# Altium schematic sheet lyThuyetMach.SchDoc
size 297 x 209 mm
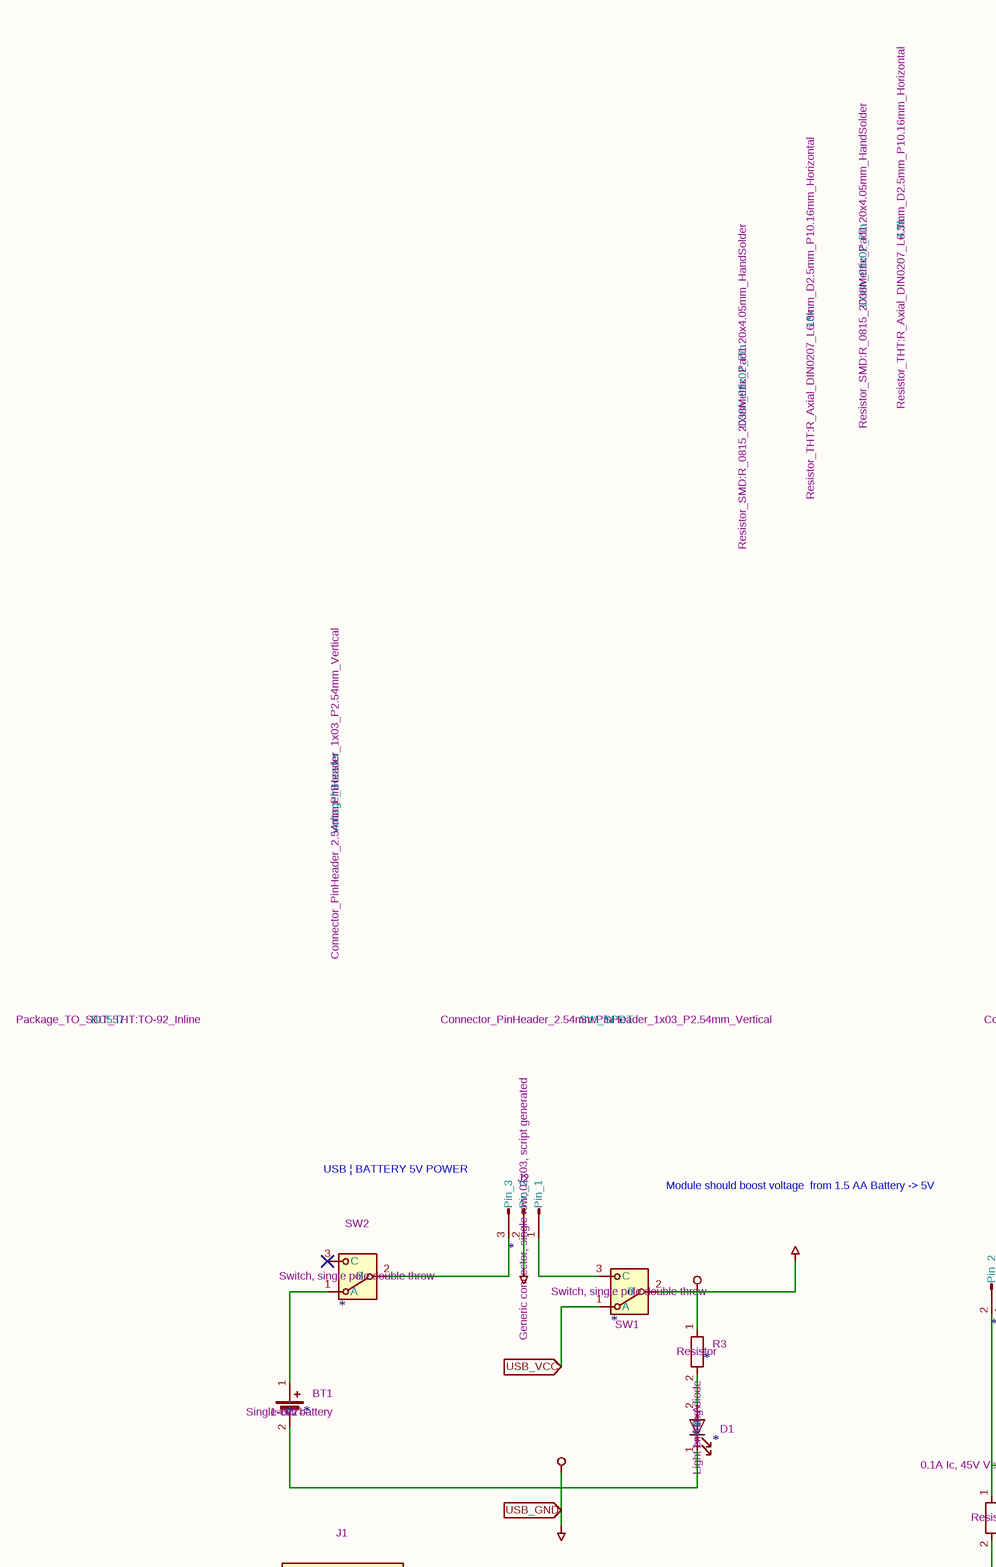
[diagram p0: lyThuyetMach.SchDoc, top left]
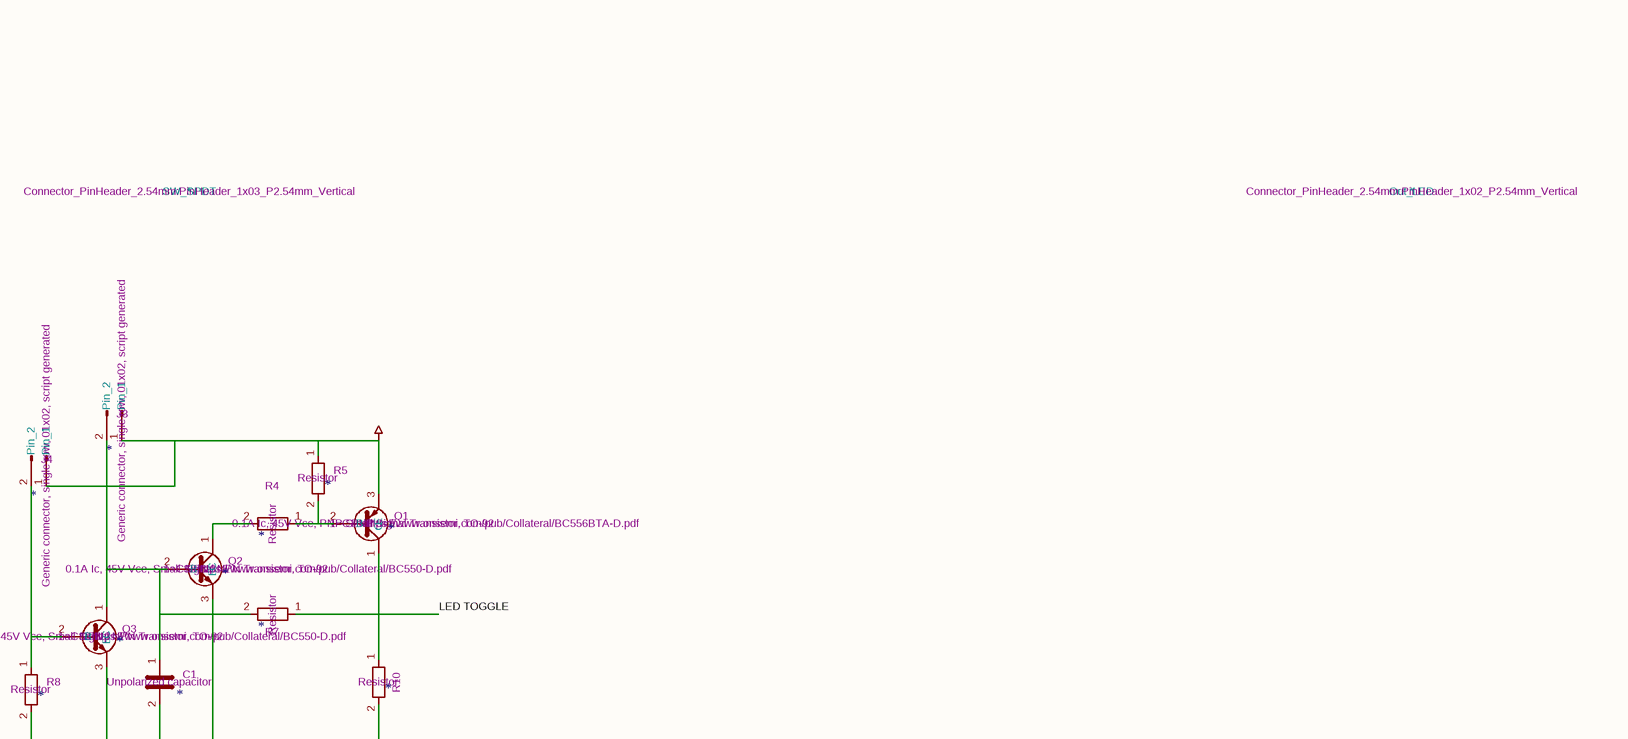
[diagram p1: lyThuyetMach.SchDoc, top right]
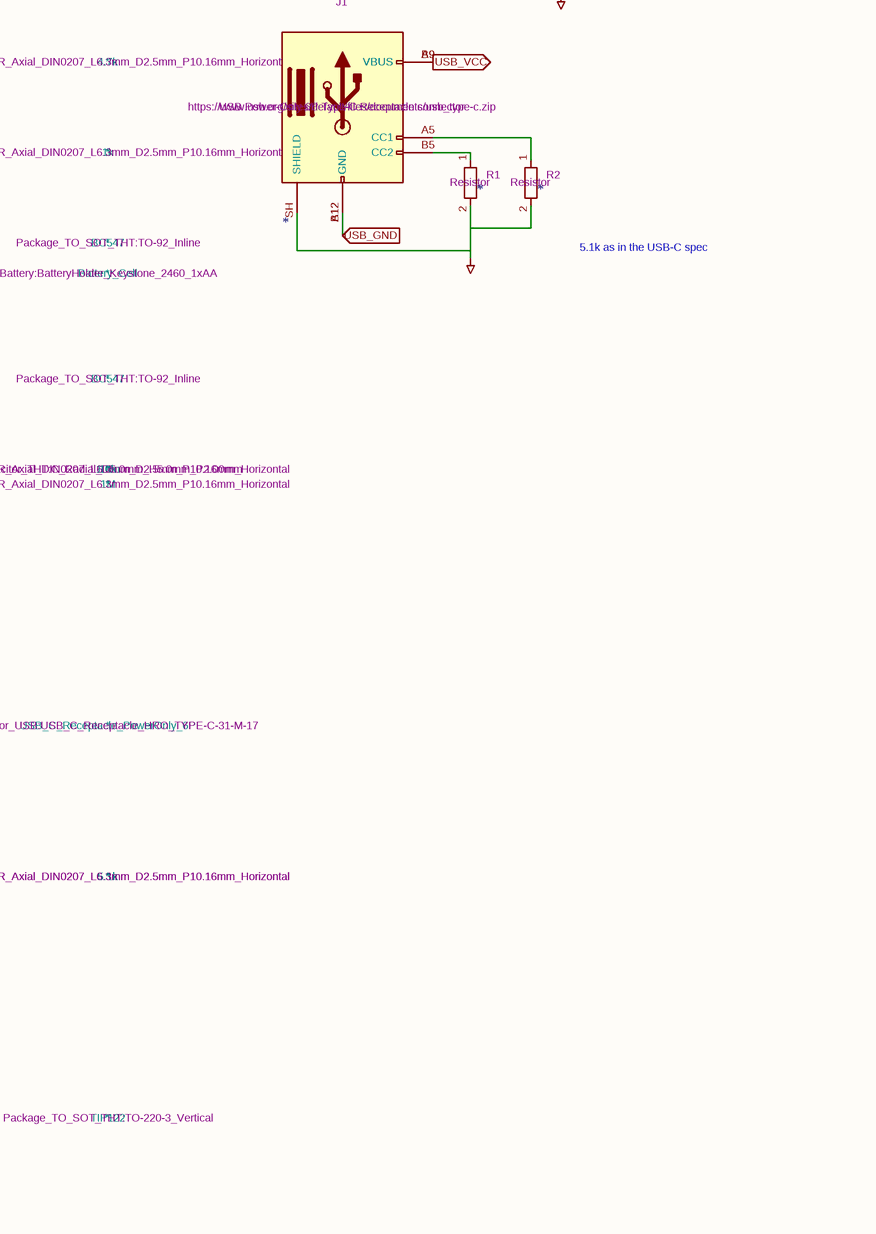
[diagram p2: lyThuyetMach.SchDoc, bottom left]
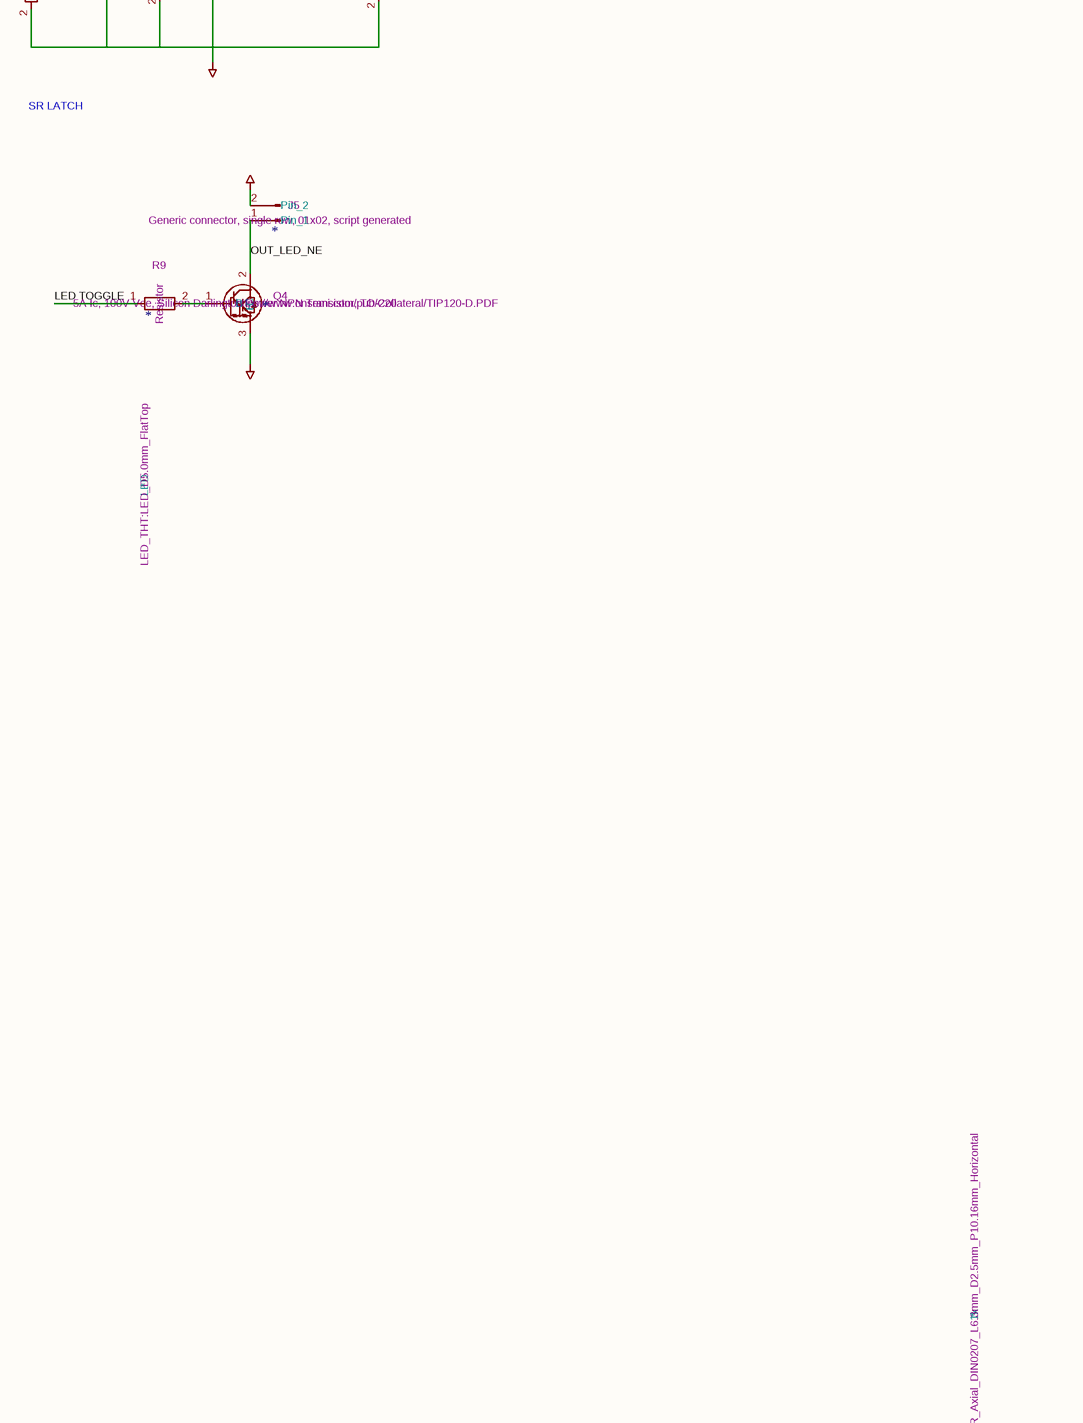
[diagram p3: lyThuyetMach.SchDoc, bottom right]

## Parts
(Parts that share a designator on the sheet are numbered #1, #2 ... from top to bottom, then left to right.)
*#1  *  value Voltage_Booster  Reference: J2  Footprint: Connector_PinHeader_2.54mm:PinHeader_1x03_P2.54mm_Vertical  Description: Generic connector, single row, 01x03, script generated
*#2  *  value Conn_01x02_Pin  Reference: J3  Footprint: Resistor_SMD:R_0815_2038Metric_Pad1.20x4.05mm_HandSolder  Description: Generic connector, single row, 01x02, script generated
*#3  *  value SW_SPDT  Reference: SW2  Footprint: Connector_PinHeader_2.54mm:PinHeader_1x03_P2.54mm_Vertical  Description: Switch, single pole double throw
*#4  *  value Conn_01x02_Pin  Reference: J4  Footprint: Resistor_SMD:R_0815_2038Metric_Pad1.20x4.05mm_HandSolder  Description: Generic connector, single row, 01x02, script generated
*#5  *  value SW_SPDT  Reference: SW1  Footprint: Connector_PinHeader_2.54mm:PinHeader_1x03_P2.54mm_Vertical  Description: Switch, single pole double throw
*#6  *  value 4.7k  Reference: R5  Footprint: Resistor_THT:R_Axial_DIN0207_L6.3mm_D2.5mm_P10.16mm_Horizontal  Description: Resistor
*#7  *  value 1k  Reference: R3  Footprint: Resistor_THT:R_Axial_DIN0207_L6.3mm_D2.5mm_P10.16mm_Horizontal  Description: Resistor
*#8  *  value 4.7k  Reference: R4  Footprint: Resistor_THT:R_Axial_DIN0207_L6.3mm_D2.5mm_P10.16mm_Horizontal  Description: Resistor
*#9  *  value BC557  Reference: Q1  Footprint: Package_TO_SOT_THT:TO-92_Inline  Description: 0.1A Ic, 45V Vce, PNP Small Signal Transistor, TO-92  Sim.Device: PNP  Sim.Pins: 1=C 2=B 3=E
*#10  *  value BC547  Reference: Q2  Footprint: Package_TO_SOT_THT:TO-92_Inline  Description: 0.1A Ic, 45V Vce, Small Signal NPN Transistor, TO-92  Sim.Device: NPN  Sim.Pins: 1=C 2=B 3=E
*#11  *  value Battery_Cell  Reference: BT1  Footprint: Battery:BatteryHolder_Keystone_2460_1xAA  Description: Single-cell battery  Sim.Device: V  Sim.Type: DC  Sim.Pins: 1=+ 2=-
*#12  *  value LED  Reference: D1  Footprint: LED_THT:LED_D5.0mm_FlatTop  Description: Light emitting diode  Sim.Pins: 1=K 2=A
*#13  *  value 10k  Reference: R7  Footprint: Resistor_THT:R_Axial_DIN0207_L6.3mm_D2.5mm_P10.16mm_Horizontal  Description: Resistor
*#14  *  value BC547  Reference: Q3  Footprint: Package_TO_SOT_THT:TO-92_Inline  Description: 0.1A Ic, 45V Vce, Small Signal NPN Transistor, TO-92  Sim.Device: NPN  Sim.Pins: 1=C 2=B 3=E
*#15  *  value 100n  Reference: C1  Footprint: Capacitor_THT:C_Radial_D5.0mm_H5.0mm_P2.00mm  Description: Unpolarized capacitor
*#16  *  value 10k  Reference: R10  Footprint: Resistor_THT:R_Axial_DIN0207_L6.3mm_D2.5mm_P10.16mm_Horizontal  Description: Resistor
*#17  *  value 1M  Reference: R8  Footprint: Resistor_THT:R_Axial_DIN0207_L6.3mm_D2.5mm_P10.16mm_Horizontal  Description: Resistor
*#18  *  value USB_C_Receptacle_PowerOnly_6P  Reference: J1  Footprint: Connector_USB:USB_C_Receptacle_HRO_TYPE-C-31-M-17  Description: USB Power-Only 6P Type-C Receptacle connector
*#19  *  value 5.1k  Reference: R1  Footprint: Resistor_THT:R_Axial_DIN0207_L6.3mm_D2.5mm_P10.16mm_Horizontal  Description: Resistor
*#20  *  value 5.1k  Reference: R2  Footprint: Resistor_THT:R_Axial_DIN0207_L6.3mm_D2.5mm_P10.16mm_Horizontal  Description: Resistor
*#21  *  value Out_LED  Reference: J5  Footprint: Connector_PinHeader_2.54mm:PinHeader_1x02_P2.54mm_Vertical  Description: Generic connector, single row, 01x02, script generated
*#22  *  value 1k  Reference: R9  Footprint: Resistor_THT:R_Axial_DIN0207_L6.3mm_D2.5mm_P10.16mm_Horizontal  Description: Resistor
*#23  *  value TIP122  Reference: Q4  Footprint: Package_TO_SOT_THT:TO-220-3_Vertical  Description: 5A Ic, 100V Vce, Silicon Darlington Power NPN Transistor, TO-220

## Ports
USB_GND (in), USB_VCC (in)

## Nets
USB_GND: *#1.2(Pin_2) *#2.1(Pin_1) *#4.1(Pin_1) *#5.2(B) *#6.1 *#7.1 *#9.3(E) *#10.3(E) *#11.2(-) *#12.1(K) *#14.3(E) *#15.2 *#16.2 *#17.2 *#18.A12(GND) *#18.B12(GND) *#18.SH(SHIELD) *#19.2 *#20.2 *#21.2(Pin_2) *#23.3(E) ; port USB_GND
LED TOGGLE: *#9.1(C) *#13.1 *#16.1 *#22.1
OUT_LED_NE: *#21.1(Pin_1) *#23.2(C)
USB_VCC: *#5.1(A) *#18.A9(VBUS) *#18.B9(VBUS) ; port USB_VCC
Net*#1_1: *#1.1(Pin_1) *#5.3(C)
Net*#1_3: *#1.3(Pin_3) *#3.2(B)
Net*#2_2: *#2.2(Pin_2) *#10.2(B) *#13.2 *#14.1(C) *#15.1
Net*#3_1: *#3.1(A) *#11.1(+)
Net*#4_2: *#4.2(Pin_2) *#14.2(B) *#17.1
Net*#6_2: *#6.2 *#8.1 *#9.2(B)
Net*#7_2: *#7.2 *#12.2(A)
Net*#8_2: *#8.2 *#10.1(C)
Net*#18_A5: *#18.A5(CC1) *#20.1
Net*#18_B5: *#18.B5(CC2) *#19.1
Net*#22_2: *#22.2 *#23.1(B)

Not connected (* = marked no-connect by the designer): *#3 3(C)*

## Notes on the sheet
- USB | BATTERY 5V POWER
- Module should boost voltage
  from 1.5 AA Battery -> 5V
- SR LATCH
- 5.1k as in the USB-C spec
- 1
- 2
- 3
- 4
- 5
- 6
- A
- B
- C
- D
- Title:
- File: lyThuyetMach.kicad_sch
- Sheet: /
- KiCad E.D.A.  kicad (5.1.4)-1
- Size: A4
- Date:
- Rev:
- Id: 1/1

## Library data of the parts
*#1 = Conn_01x03_Pin
*#2 *#4 *#21 = Conn_01x02_Pin
*#3 *#5 = SW_SPDT
*#6-*#8 *#13 *#16 *#17 *#19 *#20 *#22 = R
*#9 = BC557: Datasheet: https://www.onsemi.com/pub/Collateral/BC556BTA-D.pdf
*#10 *#14 = BC547: Datasheet: https://www.onsemi.com/pub/Collateral/BC550-D.pdf
*#11 = Battery_Cell
*#12 = LED
*#15 = C
*#18 = USB_C_Receptacle_PowerOnly_6P: Datasheet: https://www.usb.org/sites/default/files/documents/usb_type-c.zip
*#23 = TIP122: Datasheet: https://www.onsemi.com/pub/Collateral/TIP120-D.PDF